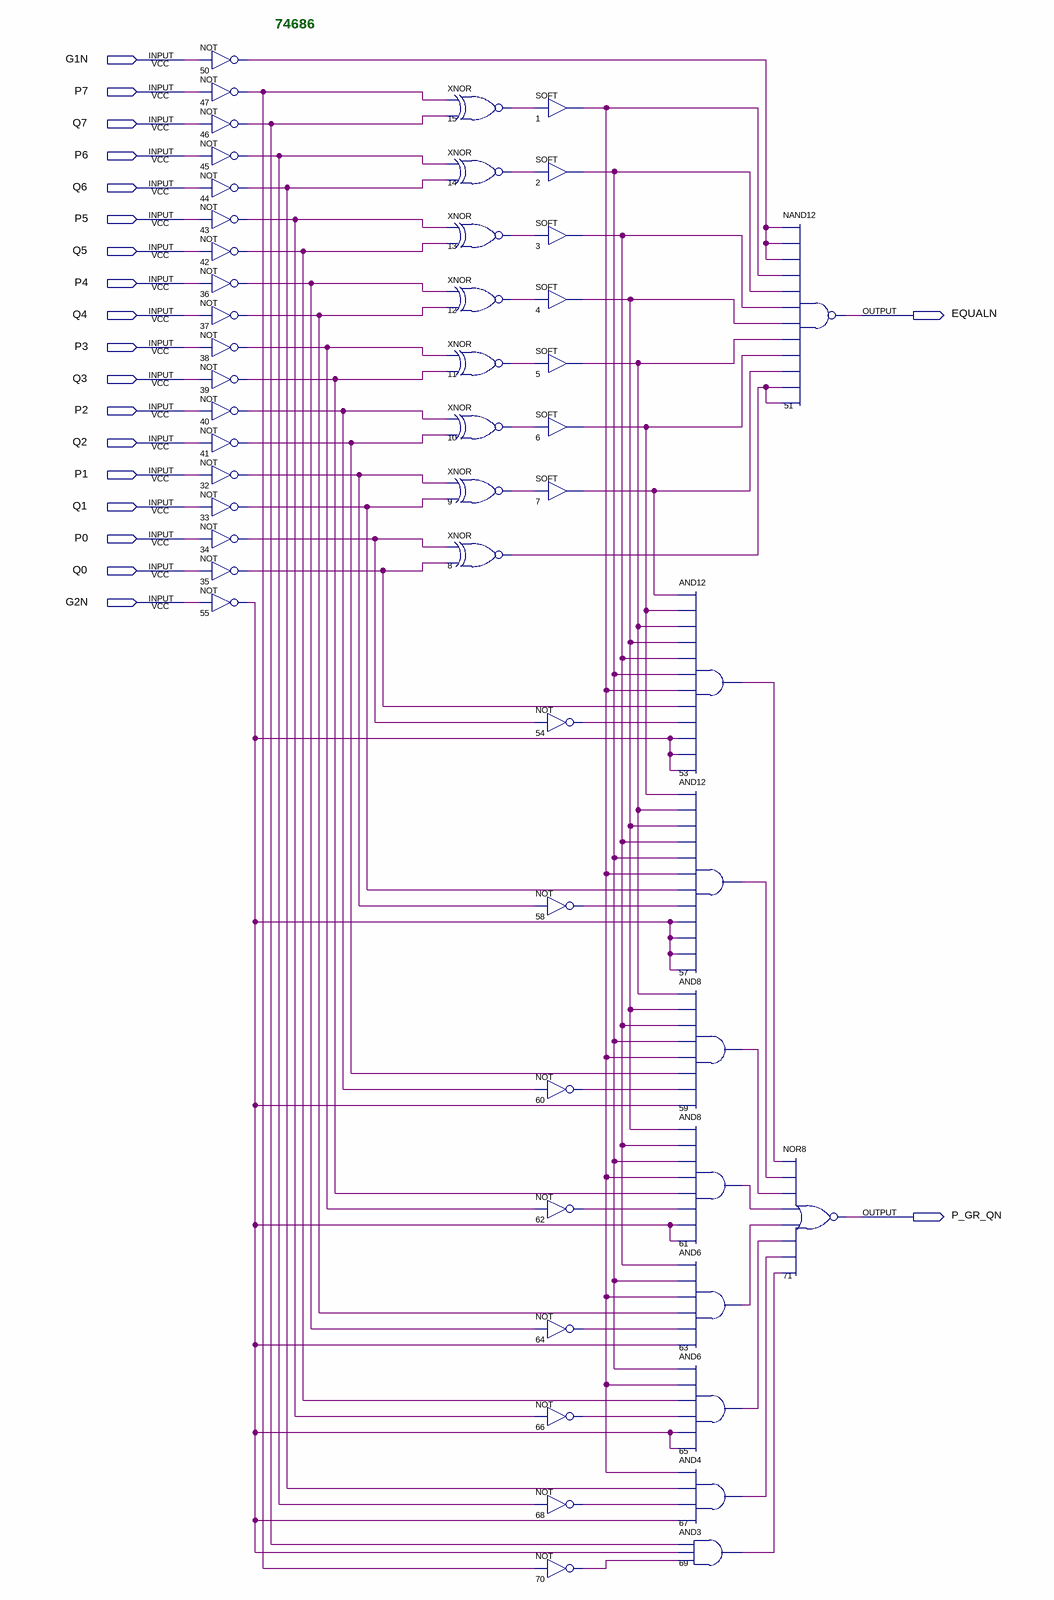
[diagram p0: schematic sheet]
// Quartus schematic 74686.bdf as structural Verilog: 51 symbols, 20 pins
module \74686  (
  input  G1N,
  input  P7,
  input  Q7,
  input  P6,
  input  Q6,
  input  P5,
  input  Q5,
  input  P4,
  input  Q4,
  input  P3,
  input  Q3,
  input  P2,
  input  Q2,
  input  P1,
  input  Q1,
  input  P0,
  input  Q0,
  input  G2N,
  output EQUALN,
  output P_GR_QN
);

  wire n1_out, n2_out, n3_out, n4_out, n5_out, n6_out, n7_out, n8_out, n9_out, n10_out, n11_out, n12_out,
       n13_out, n14_out, n15_out, n32_out, n33_out, n34_out, n35_out, n36_out, n37_out, n38_out, n39_out,
       n40_out, n41_out, n42_out, n43_out, n44_out, n45_out, n46_out, n47_out, n50_out, n53_out, n54_out,
       n55_out, n57_out, n58_out, n59_out, n60_out, n61_out, n62_out, n63_out, n64_out, n65_out, n66_out,
       n67_out, n68_out, n69_out, n70_out;

  not u_50 (n50_out, G1N);
  not u_47 (n47_out, P7);
  not u_46 (n46_out, Q7);
  not u_45 (n45_out, P6);
  not u_44 (n44_out, Q6);
  not u_43 (n43_out, P5);
  not u_42 (n42_out, Q5);
  not u_36 (n36_out, P4);
  not u_37 (n37_out, Q4);
  not u_38 (n38_out, P3);
  not u_39 (n39_out, Q3);
  not u_40 (n40_out, P2);
  not u_41 (n41_out, Q2);
  not u_32 (n32_out, P1);
  not u_33 (n33_out, Q1);
  not u_34 (n34_out, P0);
  not u_35 (n35_out, Q0);
  not u_55 (n55_out, G2N);
  xnor u_15 (n15_out, n47_out, n46_out);
  xnor u_14 (n14_out, n45_out, n44_out);
  xnor u_13 (n13_out, n43_out, n42_out);
  xnor u_12 (n12_out, n36_out, n37_out);
  xnor u_11 (n11_out, n38_out, n39_out);
  xnor u_10 (n10_out, n40_out, n41_out);
  xnor u_9 (n9_out, n32_out, n33_out);
  xnor u_8 (n8_out, n34_out, n35_out);
  SOFT u_1 (.IN(n15_out), .OUT(n1_out));
  SOFT u_2 (.IN(n14_out), .OUT(n2_out));
  SOFT u_3 (.IN(n13_out), .OUT(n3_out));
  SOFT u_4 (.IN(n12_out), .OUT(n4_out));
  SOFT u_5 (.IN(n11_out), .OUT(n5_out));
  SOFT u_6 (.IN(n10_out), .OUT(n6_out));
  SOFT u_7 (.IN(n9_out), .OUT(n7_out));
  not u_54 (n54_out, n34_out);
  not u_58 (n58_out, n32_out);
  not u_60 (n60_out, n40_out);
  not u_62 (n62_out, n38_out);
  not u_64 (n64_out, n36_out);
  not u_66 (n66_out, n43_out);
  not u_68 (n68_out, n45_out);
  not u_70 (n70_out, n47_out);
  and u_53 (n53_out, n7_out, n6_out, n5_out, n4_out, n3_out, n2_out, n1_out, n35_out, n54_out, n55_out, n55_out, n55_out);
  and u_57 (n57_out, n6_out, n5_out, n4_out, n3_out, n2_out, n1_out, n33_out, n58_out, n55_out, n55_out, n55_out, n55_out);
  and u_59 (n59_out, n5_out, n4_out, n3_out, n2_out, n1_out, n41_out, n60_out, n55_out);
  and u_61 (n61_out, n4_out, n3_out, n2_out, n1_out, n39_out, n62_out, n55_out, n55_out);
  and u_63 (n63_out, n3_out, n2_out, n1_out, n37_out, n64_out, n55_out);
  and u_65 (n65_out, n2_out, n1_out, n42_out, n66_out, n55_out, n55_out);
  and u_67 (n67_out, n1_out, n44_out, n68_out, n55_out);
  and u_69 (n69_out, n46_out, n55_out, n70_out);
  nand u_51 (EQUALN, n50_out, n50_out, n50_out, n1_out, n2_out, n3_out, n4_out, n5_out, n6_out, n7_out, n8_out, n8_out);
  nor u_71 (P_GR_QN, n53_out, n57_out, n59_out, n61_out, n63_out, n65_out, n67_out, n69_out);

  // Notes on the sheet:
  //   74686
endmodule
